# Altium project 1000374.PrjPCB
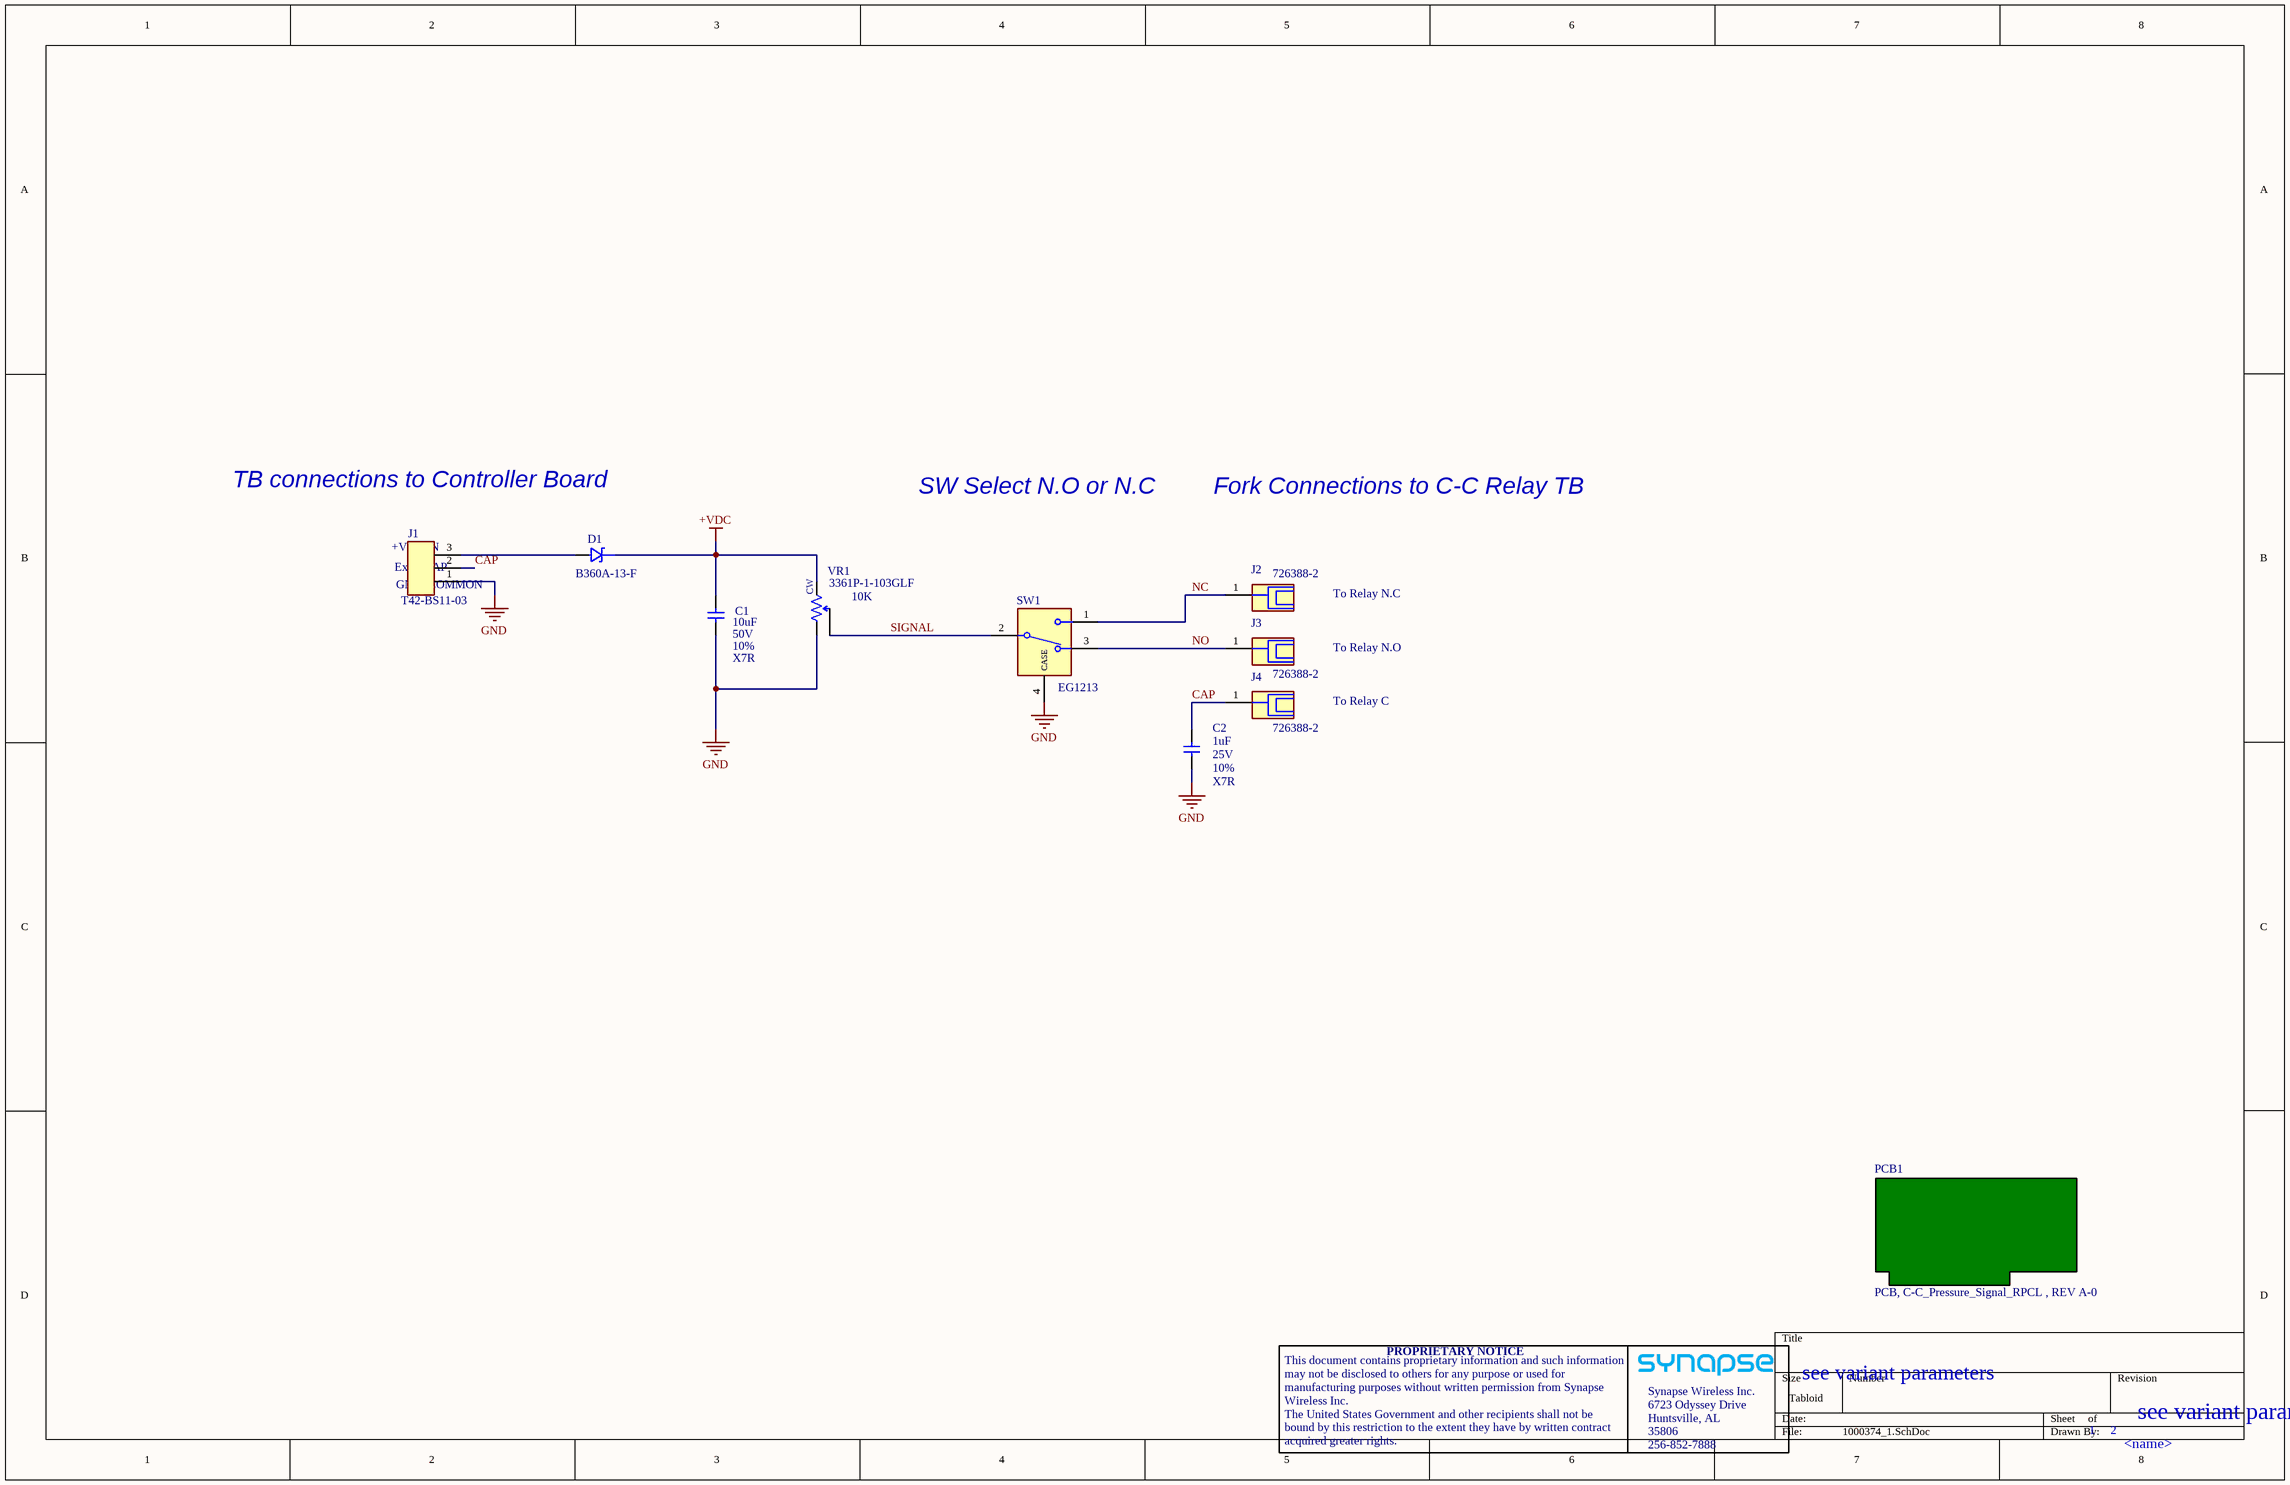
[diagram p0: 1000374_1.SchDoc]
2 sheets, 10 parts. Net scope: global (net labels, ports and power ports of the same name join across sheets).
Board file: 1000374.PCBDOC
Sheets:
  1000374_1.SchDoc
  1000374_ChangeLog.SchDoc

## Sheet 1000374_1.SchDoc: see variant params
size Tabloid; CompanyName: Synapse Wireless Inc.; DrawnBy: <name>; Engineer: <name>; Address1: 6723 Odyssey Drive; Address2: Huntsville, AL 35806; Revision: see variant parameters; SheetNumber: 1; SheetTotal: 2; DocumentTitle: see variant params; SchematicNumber: see variant parameters; AssemblyName: see variant parameters; PCBArevision: see variant parameters

### Parts
C1  value 10uF  TEMP COEFFICIENT: X7R  TOLERANCE: 10%  VOLTAGE: 50V  [CAPC1210(3225Metric)N]  (hidden comment: GRM32ER71H106KA12L)
C2  value 1uF  TEMP COEFFICIENT: X7R  TOLERANCE: 10%  VOLTAGE: 25V  [CAPC0603(1608Metric)L]  (hidden comment: C0603C105K3RACTU)
D1  B360A-13-F  [DIODE_DO-214AC (SMA)_5.3X2.8X2.3MM]
J1  T42-BS11-03  [TE_2-1437667-5-3 POS]
J2  726388-2  [TE_726388-2_SM]
J3  726388-2  [TE_726388-2_SM]
J4  726388-2  [TE_726388-2_SM]
PCB1  PCB, C-C_Pressure_Signal_RPCL , REV A-0  (mechanical)
SW1  EG1213  [SWITCH_PTH_E-SWITCH_EG1213]
VR1  3361P-1-103GLF  value 10K  [TRIM_3361P-1-103GLF]

### Nets
+VDC: C1.2 D1.K VR1.3
GND: C1.1 C2.2 J1.1 SW1.4(CASE) VR1.1
CAP: C2.1 J1.2 J4.1(GND)
NC: J2.1(GND) SW1.1
NO: J3.1(GND) SW1.3
SIGNAL: SW1.2 VR1.2
NetD1_A: D1.A J1.3

### Notes on the sheet
- TB connections to Controller Board
- SW Select N.O or N.C
- Fork Connections to C-C Relay TB
- (near J1) +VDC IN
- (near J1) Extra CAP
- (near J1) GND/ COMMON
- To Relay N.C
- To Relay N.O
- To Relay C
- This document contains proprietary information and such information
- PROPRIETARY NOTICE
- may not be disclosed to others for any purpose or used for
- manufacturing purposes without written permission from Synapse
- Wireless Inc.
- The United States Government and other recipients shall not be
- bound by this restriction to the extent they have by written contract
- Synapse Wireless Inc.
- 6723 Odyssey Drive
- Huntsville, AL
- 35806
- acquired greater rights.
- 256-852-7888
- (in symbol POTEN002) CW

### Library data of the parts
C1 = CAP441-A.1: Capacitor, ceramic, 10µF, 50V, 10%, X7R, 1210 (3225 Metric), 2.7 mm height, general purpose; PART DESCRIPTION: CAPACITOR,CER,10µF,50V,10%,X7R,1210; PART NUMBER: CAP441; MFG: Murata; BOM NOTE: -; CONSTRUCTION: ceramic; MFG PART NUMBER: GRM32ER71H106KA12L; PACKAGE: 1210; PART TYPE: Capacitor; PRICE: -
C2 = CAP294: Capacitor, ceramic, 1uF, 25V, 10%, X7R, 0603 (1608 Metric), 0.9mm height, SMT; PART DESCRIPTION: CAPACITOR,CER,1uF,25V,10%,X7R,0603; SYNAPSE PN: CAP294; Designator: CAP294-A.1; MFG: KEMET; Part Number: CAP294; BOM NOTE: -; Component Kind: Standard; Component Type: Standard; CONSTRUCTION: ceramic; Library Reference: CAP; MFG PART NUMBER: C0603C105K3RACTU; PACKAGE: 0603; PART TYPE: Capacitor; Pin Count: 2; PRICE: ?
D1 = DIO153-A.1: Diode, schottky, 60V, 3A, 700mV forward voltage @ 3A, fast recovery, DO-214AC, 5.6x2.9x2.4mm; PART DESCRIPTION: DIODE,SCHOTTKY,FAST REC,60V,3A,DO-214AC; PART NUMBER: DIO153; MFG: Diodes Inc; BOM NOTE: -; DATASHEET: https://engr.synapse-wireless.com/svn/repo1/Altium Vault/DataSheets/DiodesInc_B360A-13-F.pdf; DATASHEET 2: -; DESIGN NOTE: -; MFG PART NUMBER: B360A-13-F; OPERATING TEMP: -55C - 150C; PART TYPE: Diode; PRICE: ?
J1 = CON481: CONN,BARRIER STRIP, 3POS, 0.325" PITCH, 14-22AWG,300V,15A,CAPTIVE PLATE,3-WALL,NO COVER; PART DESCRIPTION: CONN,BAR-STRIP,3P 0.325"PITCH,14-22AWG,300V,15A,N-COV,3WL; MFG: SWITCHLAB INC; BOM NOTE: -; OPERATING TEMP: -40 - 105C; DESIGN NOTE: -; MFG PART NUMBER: T42-BS11-03; PART NUMBER: CON481; PART TYPE: Connector; PRICE: ?
J2-J4 = CON???: Connector, SMT EDGE, QC TAB, SOLDER, for screw fork use, 13.8x6.4x4.75mm; MFG PART NUMBER: 142-0771-831; PART DESCRIPTION: CONN,RF SMA JACK,FEMALE,THREADED,SMT; PART NUMBER: CON237; MFG: EMERSON; BOM NOTE: -; DATASHEET: https://engr.synapse-wireless.com/svn/repo1/Altium Vault/Components/Connectors/RF/Data Sheets/EMERSON_142-0771-831.pdf; DESIGN NOTE: -; PART TYPE: Connector; PRICE: ?; DATASHEET 2: https://engr.synapse-wireless.com/svn/repo1/Altium Vault/Components/Connectors/RF/Data Sheets/EMERSON_142-0771-831_DRAWING.pdf
PCB1 = PCB2-A.1: Bare PCB; PART NUMBER: 1000374; MFG: SYNAPSE; MFG PART NUMBER: 1000374; PART DESCRIPTION: PCB, C-C_Pressure_Signal_RPCL , REV A-0; DESIGN NOTE: -; PRICE: ?; BOM NOTE: -; PART TYPE: PCB
SW1 = SW044-A.1: Switch, slide, SPDT, standard, 200mA, 30V, RA, PTH, 10x8.8x5mm; PART DESCRIPTION: SWITCH,SLIDE,SPDT,200mA,30VDC,RA,PTH; PART NUMBER: SW044; MFG: E-Switch; BOM NOTE: -; DATASHEET: https://engr.synapse-wireless.com/svn/repo1/Altium Vault/DataSheets/ESwitch_EG1213.pdf; DATASHEET 2: https://engr.synapse-wireless.com/svn/repo1/Altium Vault/DataSheets/ESwitch_EG1213_2.pdf; DESIGN NOTE: -; MFG PART NUMBER: EG1213; OPERATING TEMP: -20C - 70C; PART TYPE: Switch; PRICE: ?
VR1 = POTEN002: Potentiometer, trimmer, cermet, 10K, 0.5W, top adjust, 1.0 turns, 10%, 100ppm, SM, 7.04mmx6.7mm; PART DESCRIPTION: POTENTIOMETER, TRIM, 10K, 1.0 TURN TOP ADJ, SM, GULL WING; MFG: BOURNS; BOM NOTE: -; DESIGN NOTE: -; MFG PART NUMBER: 3361P-1-103GLF; PART NUMBER: POTEN002; PART TYPE: potentiometer; PRICE: ?

## Sheet 1000374_ChangeLog.SchDoc: see variant params
size Tabloid; CompanyName: Synapse Wireless Inc.; DrawnBy: <name>; Engineer: <name>; Address1: 6723 Odyssey Drive; Address2: Huntsville, AL 35806; Revision: see variant parameters; SheetNumber: 2; SheetTotal: 2; DocumentTitle: see variant params; SchematicNumber: see variant parameters; AssemblyName: see variant parameters; PCBArevision: see variant parameters
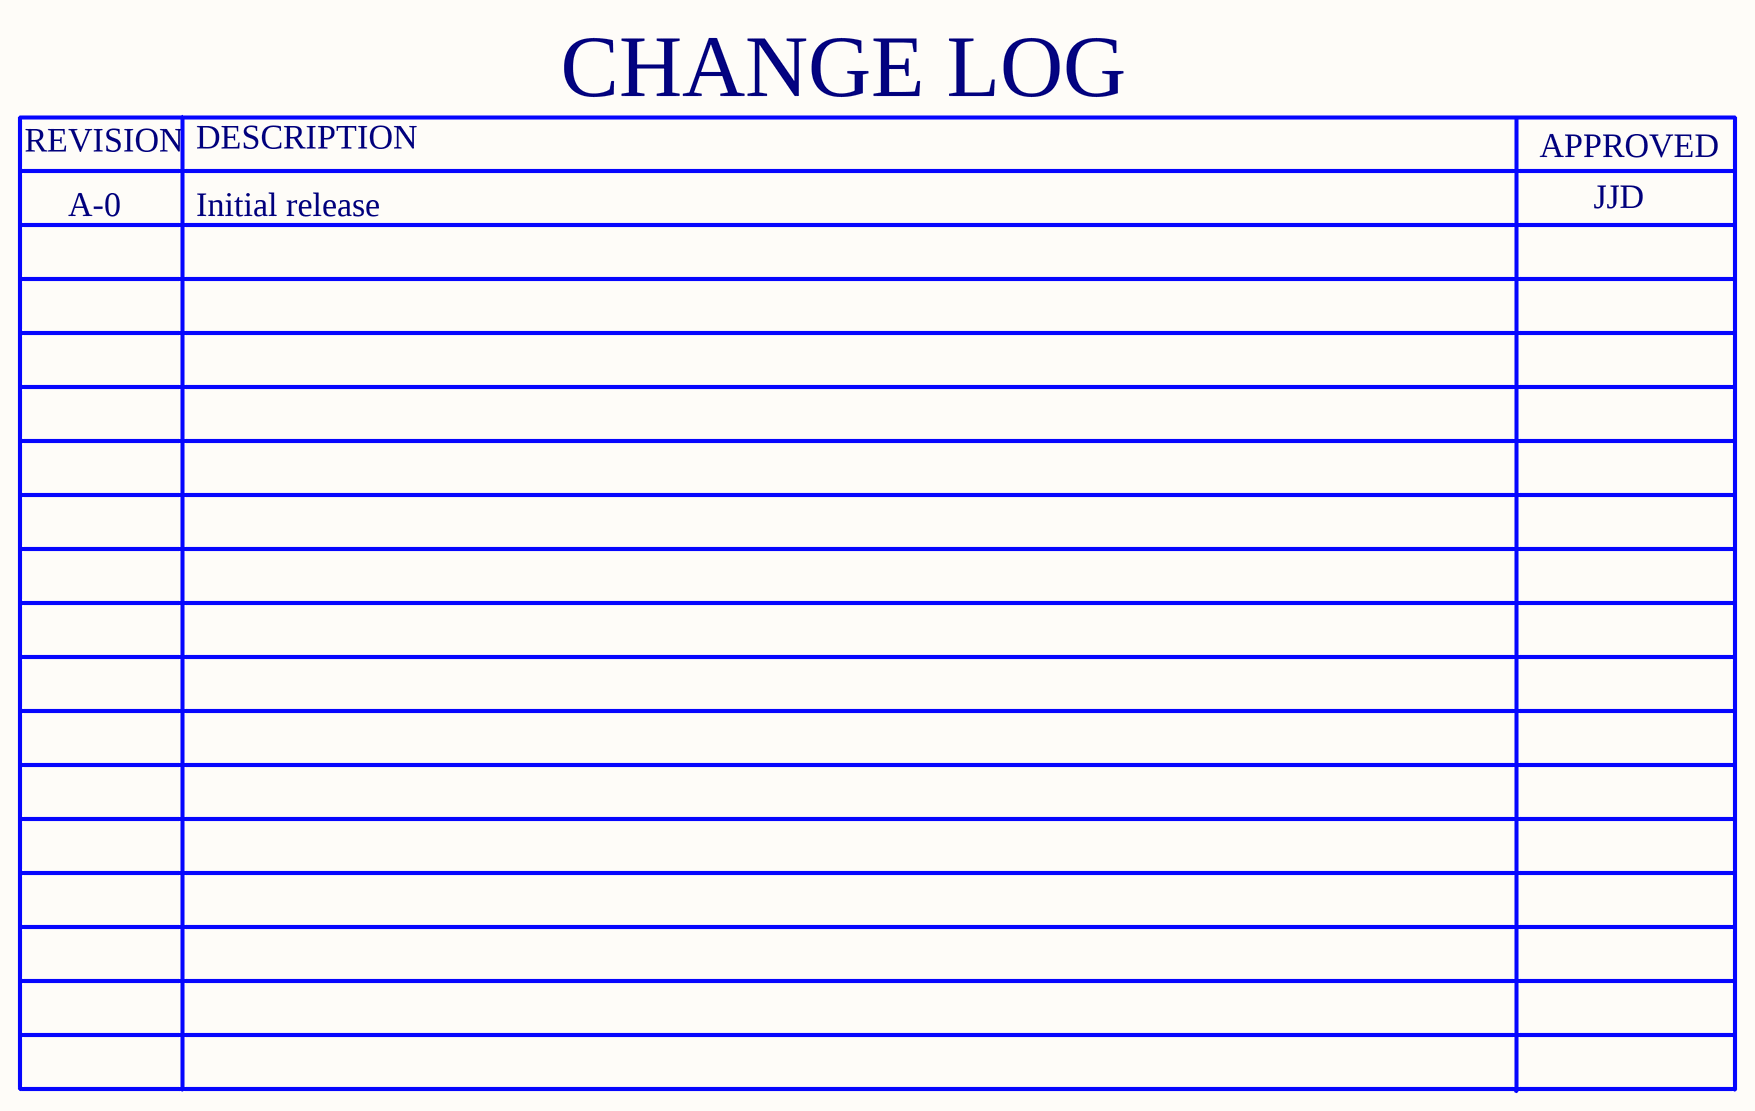
[diagram p1: 1000374_ChangeLog.SchDoc]

### Notes on the sheet
- REVISION
- DESCRIPTION
- CHANGE LOG
- A-0
- Initial release
- APPROVED
- JJD
- This document contains proprietary information and such information
- PROPRIETARY NOTICE
- may not be disclosed to others for any purpose or used for
- manufacturing purposes without written permission from Synapse
- Wireless Inc.
- The United States Government and other recipients shall not be
- bound by this restriction to the extent they have by written contract
- Synapse Wireless Inc.
- 6723 Odyssey Drive
- Huntsville, AL
- 35806
- acquired greater rights.
- 256-852-7888

## Assembly variants
1000375-1: all parts fitted